# EAGLE design Quad VCA CTRL v1 (EAGLE 7.7.0)
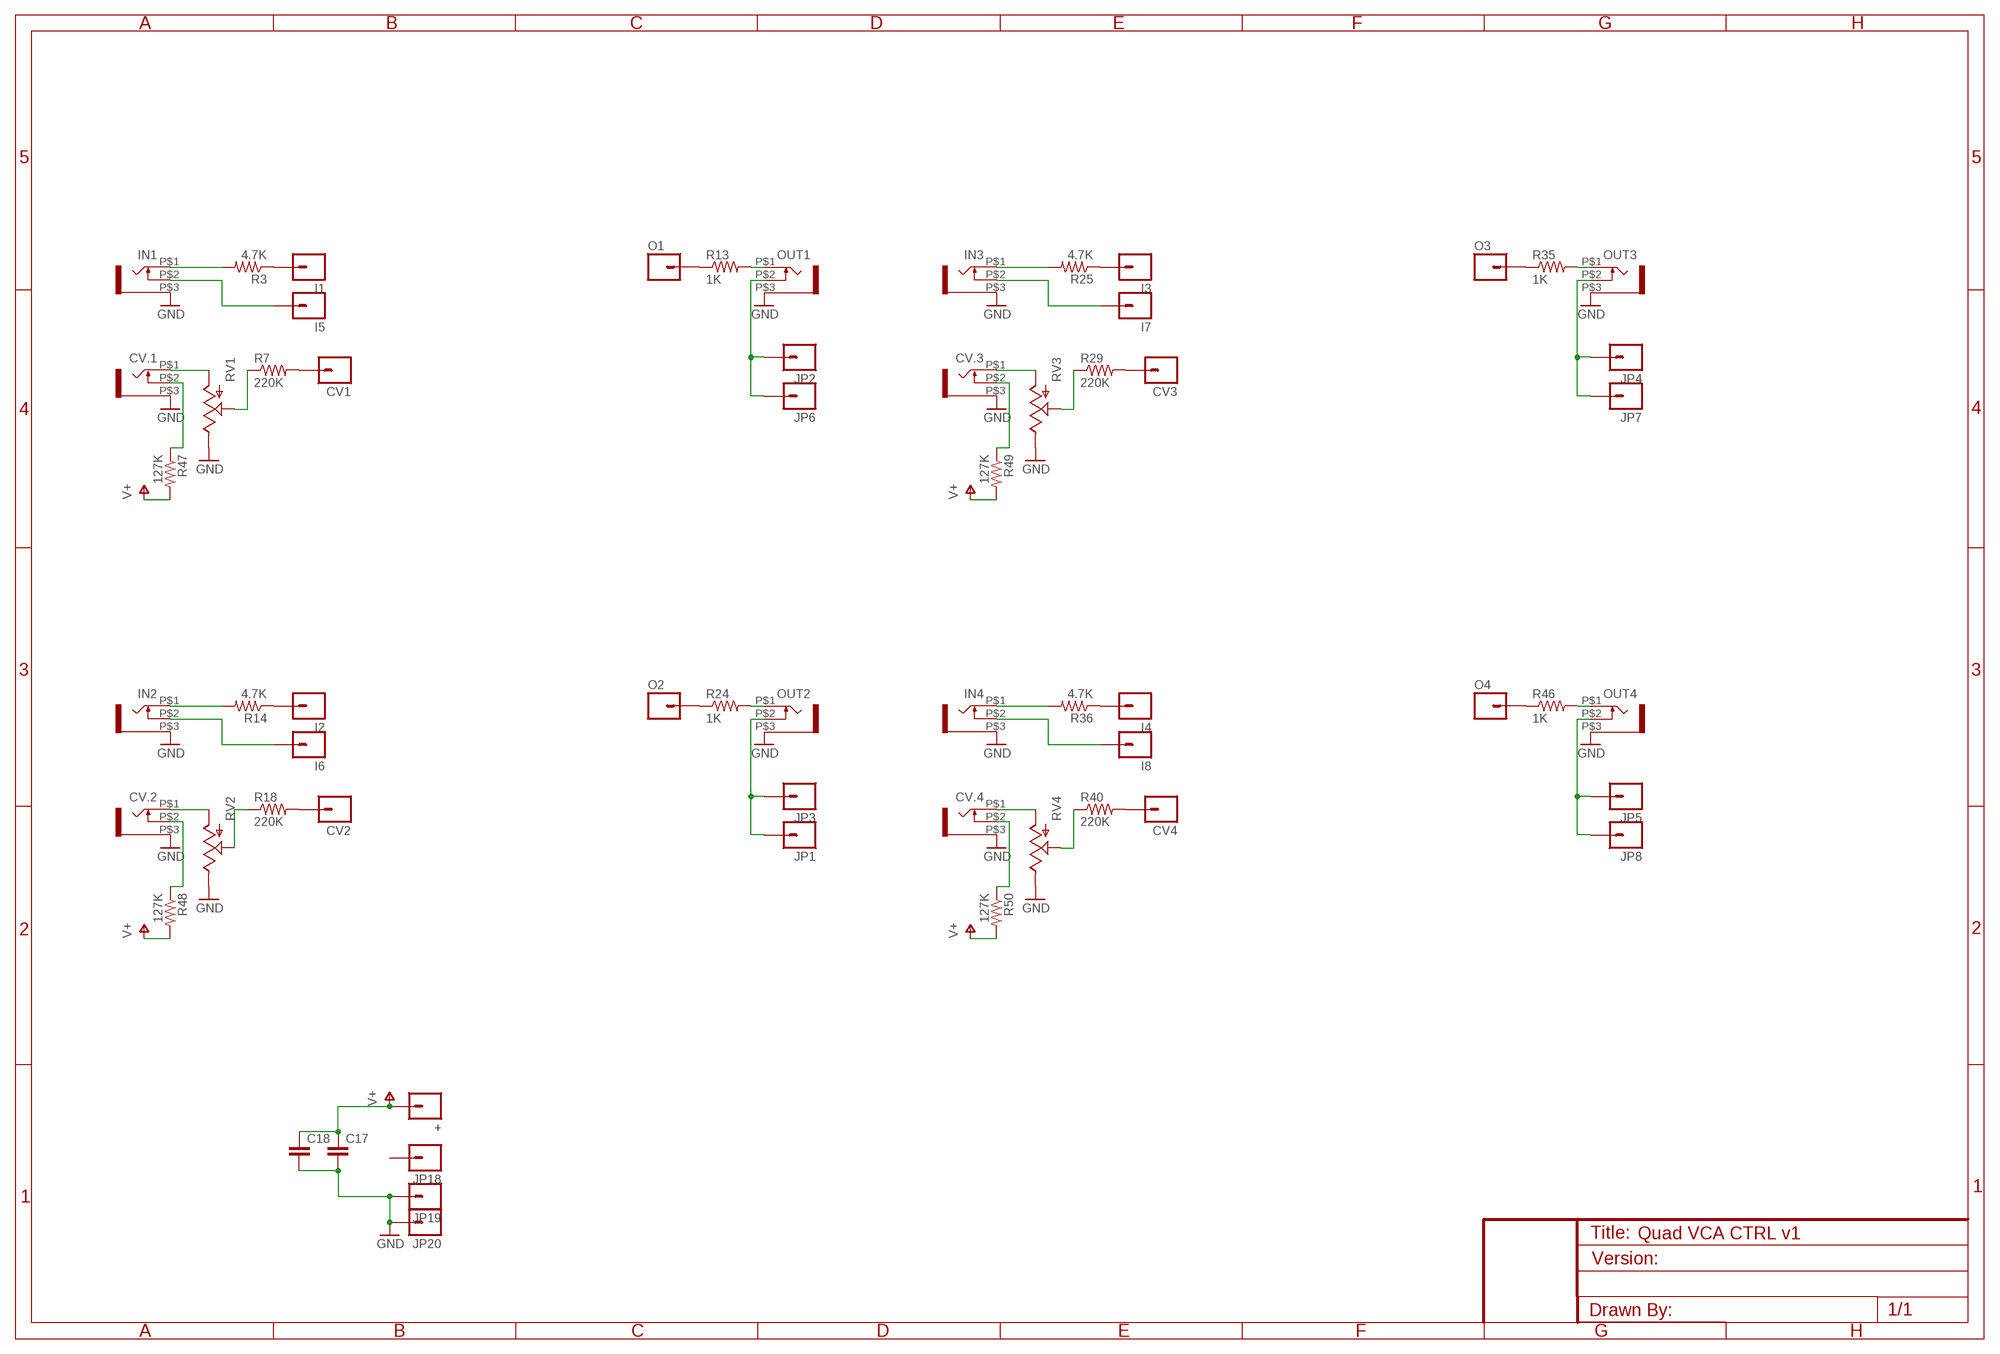
[diagram p0: schematic, sheet 1]

## Parts
+  M01PTH  [1X01]
C17  CAP0805  [0805]
C18  CAP0805  [0805]
CV1  M01PTH  [1X01]
CV2  M01PTH  [1X01]
CV3  M01PTH  [1X01]
CV4  M01PTH  [1X01]
CV.1  WQP-PJ301M-12_JACK  [WQP-PJ301M-12_JACK]
CV.2  WQP-PJ301M-12_JACK  [WQP-PJ301M-12_JACK]
CV.3  WQP-PJ301M-12_JACK  [WQP-PJ301M-12_JACK]
CV.4  WQP-PJ301M-12_JACK  [WQP-PJ301M-12_JACK]
I1  M01PTH  [1X01]
I2  M01PTH  [1X01]
I3  M01PTH  [1X01]
I4  M01PTH  [1X01]
I5  M01PTH  [1X01]
I6  M01PTH  [1X01]
I7  M01PTH  [1X01]
I8  M01PTH  [1X01]
IN1  WQP-PJ301M-12_JACK  [WQP-PJ301M-12_JACK]
IN2  WQP-PJ301M-12_JACK  [WQP-PJ301M-12_JACK]
IN3  WQP-PJ301M-12_JACK  [WQP-PJ301M-12_JACK]
IN4  WQP-PJ301M-12_JACK  [WQP-PJ301M-12_JACK]
JP1  M01PTH  [1X01]
JP2  M01PTH  [1X01]
JP3  M01PTH  [1X01]
JP4  M01PTH  [1X01]
JP5  M01PTH  [1X01]
JP6  M01PTH  [1X01]
JP7  M01PTH  [1X01]
JP8  M01PTH  [1X01]
JP18  M01PTH  [1X01]
JP19  M01PTH  [1X01]
JP20  M01PTH  [1X01]
O1  M01PTH  [1X01]
O2  M01PTH  [1X01]
O3  M01PTH  [1X01]
O4  M01PTH  [1X01]
OUT1  WQP-PJ301M-12_JACK  [WQP-PJ301M-12_JACK]
OUT2  WQP-PJ301M-12_JACK  [WQP-PJ301M-12_JACK]
OUT3  WQP-PJ301M-12_JACK  [WQP-PJ301M-12_JACK]
OUT4  WQP-PJ301M-12_JACK  [WQP-PJ301M-12_JACK]
R3  4.7K  RESISTOR0805-RES  [0805]
R7  220K  RESISTOR0805-RES  [0805]
R13  1K  RESISTOR0805-RES  [0805]
R14  4.7K  RESISTOR0805-RES  [0805]
R18  220K  RESISTOR0805-RES  [0805]
R24  1K  RESISTOR0805-RES  [0805]
R25  4.7K  RESISTOR0805-RES  [0805]
R29  220K  RESISTOR0805-RES  [0805]
R35  1K  RESISTOR0805-RES  [0805]
R36  4.7K  RESISTOR0805-RES  [0805]
R40  220K  RESISTOR0805-RES  [0805]
R46  1K  RESISTOR0805-RES  [0805]
R47  127K  RESISTOR0805-RES  [0805]
R48  127K  RESISTOR0805-RES  [0805]
R49  127K  RESISTOR0805-RES  [0805]
R50  127K  RESISTOR0805-RES  [0805]
RV1  POT  [ALPS_POT]
RV2  POT  [ALPS_POT]
RV3  POT  [ALPS_POT]
RV4  POT  [ALPS_POT]

## Nets
GND: C17.2 C18.2 CV.1.P$3 CV.2.P$3 CV.3.P$3 CV.4.P$3 IN1.P$3 IN2.P$3 IN3.P$3 IN4.P$3 JP19.1 JP20.1 OUT1.P$3 OUT2.P$3 OUT3.P$3 OUT4.P$3 RV1.P$1(E) RV2.P$1(E) RV3.P$1(E) RV4.P$1(E)
N$1: CV.1.P$2 R47.1
N$2: I1.1 R3.1
N$3: IN1.P$1 R3.2
N$4: CV1.1 R7.2
N$5: O1.1 R13.1
N$6: CV.2.P$1 RV2.P$3(A)
N$7: CV.2.P$2 R48.1
N$8: CV.3.P$2 R49.1
N$9: CV.4.P$2 R50.1
N$10: JP2.1 JP6.1 OUT1.P$2
N$11: IN2.P$1 R14.2
N$12: I2.1 R14.1
N$13: O2.1 R24.1
N$14: O3.1 R35.1
N$15: O4.1 R46.1
N$16: CV4.1 R40.2
N$17: I4.1 R36.1
N$18: CV3.1 R29.2
N$19: R18.1 RV2.P$2(S)
N$20: CV.1.P$1 RV1.P$3(A)
N$21: I3.1 R25.1
N$22: CV2.1 R18.2
N$23: I5.1 IN1.P$2
N$24: I6.1 IN2.P$2
N$25: OUT2.P$1 R24.2
N$26: IN3.P$1 R25.2
N$27: I7.1 IN3.P$2
N$28: I8.1 IN4.P$2
N$34: R7.1 RV1.P$2(S)
N$35: CV.3.P$1 RV3.P$3(A)
N$42: R29.1 RV3.P$2(S)
N$46: CV.4.P$1 RV4.P$3(A)
N$51: OUT1.P$1 R13.2
N$53: OUT3.P$1 R35.2
N$54: IN4.P$1 R36.2
N$62: R40.1 RV4.P$2(S)
N$63: JP1.1 JP3.1 OUT2.P$2
N$68: OUT4.P$1 R46.2
N$69: JP4.1 JP7.1 OUT3.P$2
N$72: JP5.1 JP8.1 OUT4.P$2
V+: +.1 C17.1 C18.1 R47.2 R48.2 R49.2 R50.2
Unconnected: JP18.1

## Library data of the parts
+ CV1-CV4 I1-I8 JP1-JP8 JP18-JP20 O1-O4 = SparkFun-Connectors:M01: Header 1 Standard 1-pin 0.1" header. Use with straight break away headers (SKU : PRT-00116), right angle break away headers (PRT-00553), swiss pins (PRT-00743), machine pins (PRT-00117), and female headers (PRT-00115).
C17 C18 = SparkFun-Capacitors:CAP: Capacitor Standard 0603 ceramic capacitor, and 0.1" leaded capacitor.
CV.1-CV.4 IN1-IN4 OUT1-OUT4 = thonkiconn:WQP-PJ301M-12_JACK
R3 R7 R13 R14 R18 R24 R25 R29 R35 R36 R40 R46-R50 = SparkFun-Resistors:RESISTOR: Resistor Basic schematic elements and footprints for 0603, 1206, and PTH resistors.
RV1-RV4 = SparkFun-Electromechanical:POT; PROD_ID: RES-09177

## Board
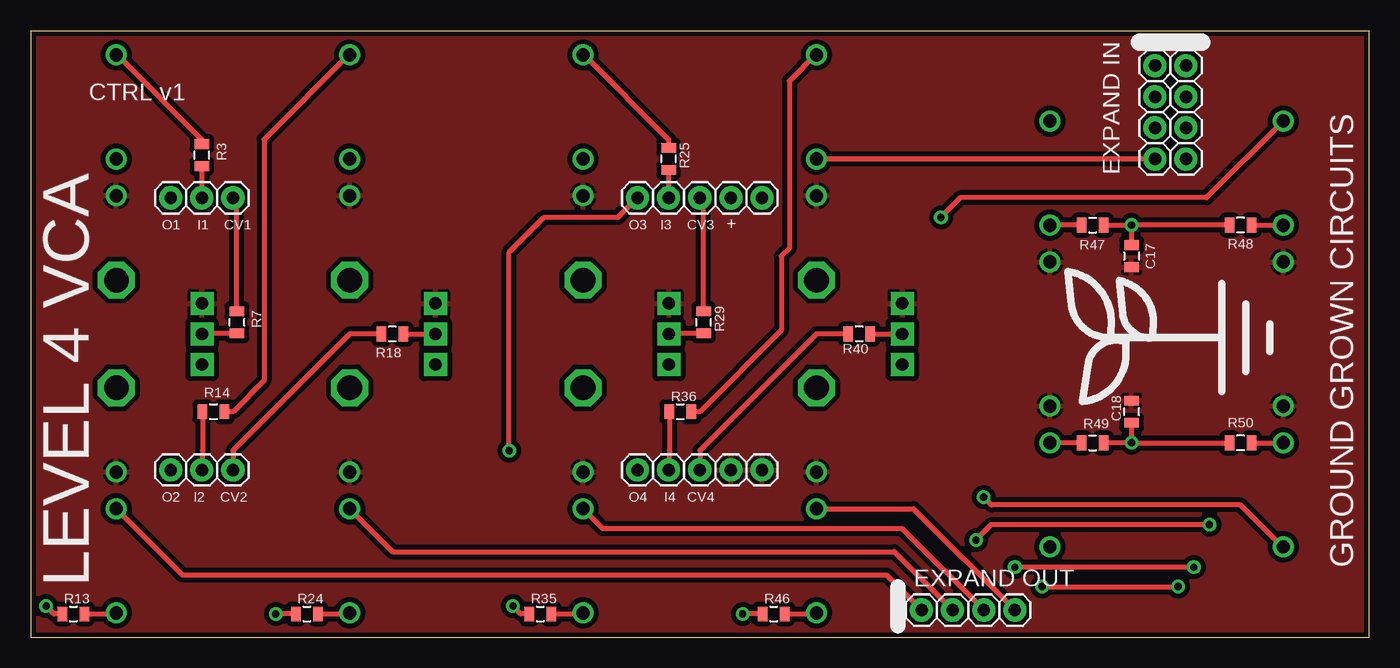
[diagram p1: board, top side]
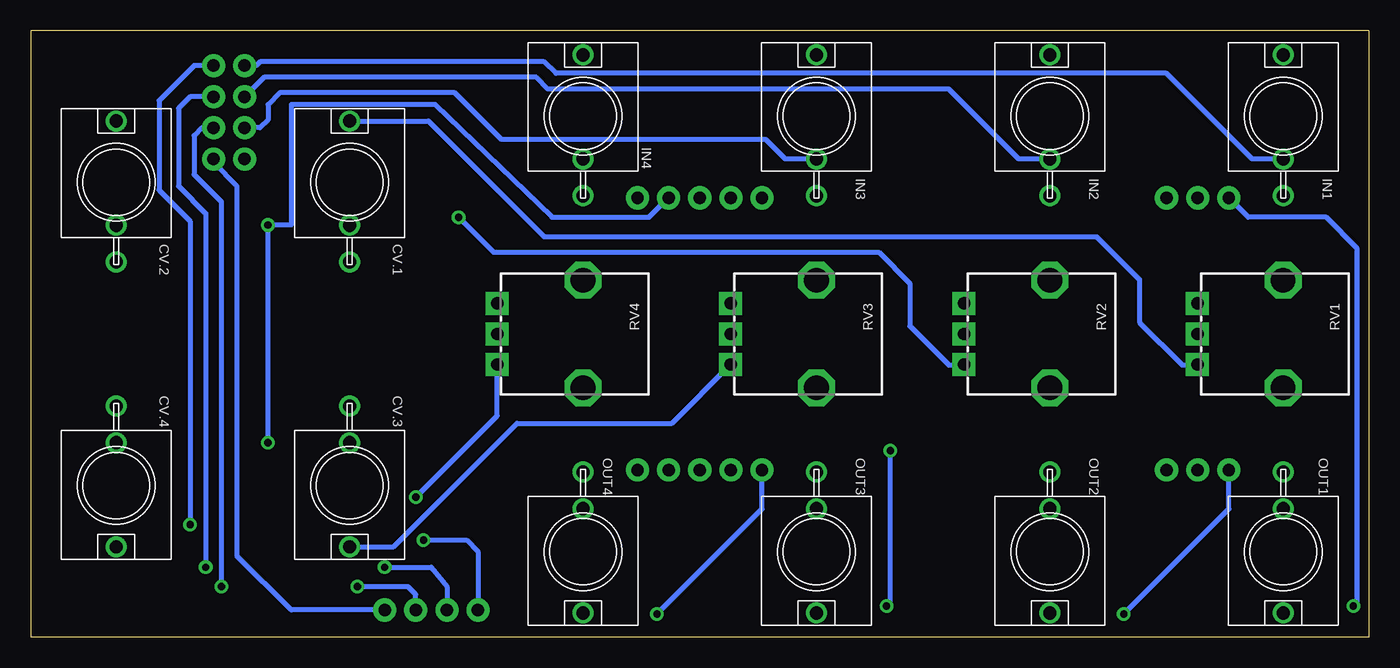
[diagram p2: board, bottom side, seen from below]

Size 109.22 x 49.53 mm. Coordinates in mm from the lower left corner, seen from the top.
Outline: 0,0 109.22,0 109.22,49.53 0,49.53 0,0
Copper layers (1*16): Top 0.035mm / dielectric 1.5mm / Bottom 0.035mm
Design rules "SparkFun": minimum track width 8mil, minimum drill 20mil, track to track 8mil, track to pad 8mil, pad to pad 8mil, via to via 8mil, smd to smd 8mil, copper to edge 8mil, drill to drill 8mil, minimum pad ring 12mil, minimum via ring 10mil, stop-mask expansion 4mil, vias tented up to drill 20mil, thermal gap 10mil

### Footprints (pad centres in the part's own frame; a part is rotated, then mirrored left to right if it is on the bottom)
1X01 = drill 1.016 pad 1.88: 1 0,0
0805 = smd 0.8 x 1.2: 1 -0.9,0; 2 0.9,0
WQP-PJ301M-12_JACK = drill 1.1: P$1 0,5; P$2 0,-3.5; P$3 0,-6.5
ALPS_POT = drill 1 pad 1.88 square: P$1 7,-2.5; P$2 7,0; P$3 7,2.5 | drill 2 octagon: P$4 0,-4.4; P$5 0,4.4

### Placement (x,y rotation side)
+  57.15,35.88 0 top
C17  89.85,31.11 270 top
C18  89.85,18.41 90 top
CV1  16.51,35.88 0 top
CV2  16.51,13.65 0 top
CV3  54.61,35.88 0 top
CV4  54.61,13.65 0 top
CV.1  83.19,37.15 0 bottom
CV.2  102.23,37.15 0 bottom
CV.3  83.19,12.38 180 bottom
CV.4  102.23,12.38 180 bottom
I1  13.97,35.88 0 top
I2  13.97,13.65 0 top
I3  52.07,35.88 0 top
I4  52.07,13.65 0 top
I5  91.76,46.67 90 top
I6  91.76,44.13 90 top
I7  91.76,41.59 90 top
I8  91.76,39.05 90 top
IN1  6.99,42.55 0 bottom
IN2  26.04,42.55 0 bottom
IN3  45.09,42.55 0 bottom
IN4  64.14,42.55 0 bottom
JP1  94.3,44.13 270 top
JP2  72.71,2.22 90 top
JP3  75.25,2.22 90 top
JP4  77.79,2.22 90 top
JP5  80.33,2.22 90 top
JP6  94.3,46.67 270 top
JP7  94.3,41.59 270 top
JP8  94.3,39.05 270 top
JP18  59.69,35.88 0 top
JP19  59.69,13.65 0 top
JP20  57.15,13.65 0 top
O1  11.43,35.88 0 top
O2  11.43,13.65 0 top
O3  49.53,35.88 0 top
O4  49.53,13.65 0 top
OUT1  6.99,6.99 180 bottom
OUT2  26.04,6.99 180 bottom
OUT3  45.09,6.99 180 bottom
OUT4  64.14,6.99 180 bottom
R3  13.97,39.37 90 top
R7  16.83,25.72 90 top
R13  3.49,1.91 0 top
R14  14.92,18.41 0 top
R18  29.53,24.77 180 top
R24  22.54,1.91 0 top
R25  52.07,39.05 90 top
R29  54.93,25.72 90 top
R35  41.59,1.91 0 top
R36  53.02,18.41 0 top
R40  67.63,24.77 180 top
R46  60.64,1.91 0 top
R47  86.68,33.66 0 top
R48  98.74,33.66 180 top
R49  86.68,15.88 0 top
R50  98.74,15.88 180 top
RV1  6.99,24.77 180 bottom
RV2  26.04,24.77 180 bottom
RV3  45.09,24.77 180 bottom
RV4  64.14,24.77 180 bottom
U$1  [LOGO_LARGE]  97.16,24.45 90 top

### Tracks (layer width: path | path; a pad name or v marks a point on that pad's centre or on a via)
GND
  pour Top (isolate 0.406): 0,0 109.22,0 109.22,49.53 0,49.53
N$1
  Top 0.406: R47.1 CV.1.P$2
N$2
  Top 0.406: R3.1 I1.1
N$3
  Top 0.406: IN1.P$1 7.07,47.55 13.97,40.64 R3.2
N$4
  Top 0.406: R7.2 16.83,35.56 CV1.1
N$5  (via drill 0.6)
  Top 0.406: R13.1 1.91,1.91 v1.27,2.54
  Bottom 0.406: v1.27,2.54 0.95,2.86 0.95,31.75 3.49,34.29 9.84,34.29 O1.1
N$6  (via drill 0.6)
  Top 0.406: CV.2.P$1 95.97,35.88 75.88,35.88 v74.3,34.29
  Bottom 0.406: v74.3,34.29 71.44,31.43 40.01,31.43 37.47,28.89 37.47,25.4 34.29,22.23 33.08,22.23 RV2.P$3
N$7
  Top 0.406: R48.1 CV.2.P$2
N$8
  Top 0.406: R49.1 CV.3.P$2
N$9
  Top 0.406: R50.1 CV.4.P$2
N$10  (via drill 0.6)
  Top 0.406: OUT1.P$2 12.38,5.08 69.85,5.08 JP2.1 | v77.15,7.94 78.42,9.21 v96.2,9.21
  Bottom 0.406: JP6.1 95.89,46.67 98.74,43.81 98.74,36.51 96.2,33.97 v96.2,9.21 | v77.15,7.94 73.66,7.94 72.71,6.99 JP2.1
N$11
  Top 0.406: IN2.P$1 25.95,47.55 19.05,40.64 19.05,20.95 16.51,18.41 R14.2
N$12
  Top 0.406: R14.1 14.02,15.29 I2.1
N$13  (via drill 0.6)
  Top 0.406: R24.1 v20,1.91
  Bottom 0.406: v20,1.91 11.43,10.48 O2.1
N$14  (via drill 0.6)
  Top 0.406: R35.1 40.01,1.91 v39.37,2.54 | v39.05,15.24 39.05,31.43 41.91,34.29 47.94,34.29 O3.1
  Bottom 0.406: v39.37,2.54 39.05,2.86 v39.05,15.24
N$15  (via drill 0.6)
  Top 0.406: R46.1 v58.1,1.91
  Bottom 0.406: v58.1,1.91 49.53,10.48 O4.1
N$16
  Top 0.406: R40.2 64.14,24.77 54.61,15.24 CV4.1
N$17
  Top 0.406: R36.1 52.12,15.29 I4.1
N$18
  Top 0.406: R29.2 54.93,35.56 CV3.1
N$19
  Top 0.406: R18.1 RV2.P$2
N$20
  Bottom 0.406: CV.1.P$1 76.75,42.15 67.31,32.7 22.23,32.7 18.73,29.21 18.73,25.72 15.24,22.23 14.03,22.23 RV1.P$3
N$21
  Top 0.406: R25.1 I3.1
N$22
  Top 0.406: R18.2 26.04,24.77 16.51,15.24 CV2.1
N$23
  Bottom 0.406: IN1.P$2 9.52,39.05 16.51,46.04 66.36,46.04 67.31,46.99 90.49,46.99 90.81,46.67 I5.1
N$24
  Bottom 0.406: IN2.P$2 28.57,39.05 34.29,44.77 66.99,44.77 67.94,45.72 90.17,45.72 I6.1
N$25
  Top 0.406: R24.2 25.95,1.91 OUT2.P$1
N$26
  Top 0.406: IN3.P$1 45.16,47.55 52.07,40.64 R25.2
N$27
  Bottom 0.406: IN3.P$2 47.62,39.05 49.21,40.64 70.8,40.64 74.61,44.45 88.9,44.45 89.85,43.5 89.85,42.23 90.49,41.59 I7.1
N$28
  Top 0.406: I8.1 IN4.P$2
N$34
  Top 0.406: R7.1 14.04,24.82 RV1.P$2
N$35
  Bottom 0.406: CV.3.P$1 79.61,7.38 69.53,17.46 56.89,17.46 RV3.P$3
N$42
  Top 0.406: R29.1 52.14,24.82 RV3.P$2
N$46  (via drill 0.6)
  Top 0.406: CV.4.P$1 102.16,7.38 98.74,10.79 78.42,10.79 v77.79,11.43
  Bottom 0.406: v77.79,11.43 71.14,18.08 RV4.P$3
N$51
  Top 0.406: R13.2 6.91,1.91 OUT1.P$1
N$53
  Top 0.406: R35.2 45.01,1.91 OUT3.P$1
N$54
  Top 0.406: IN4.P$1 64.06,47.55 61.91,45.4 61.91,31.75 61.28,31.11 61.28,25.08 54.61,18.41 R36.2
N$62
  Top 0.406: R40.1 RV4.P$2
N$63  (via drill 0.6)
  Top 0.406: OUT2.P$2 29.53,6.99 70.48,6.99 JP3.1 | v94.93,5.71 v80.33,5.71
  Bottom 0.406: JP1.1 96.2,44.13 97.16,43.18 97.16,36.83 94.93,34.61 v94.93,5.71 | v80.33,5.71 76.52,5.71 75.25,4.13 JP3.1
N$68
  Top 0.406: R46.2 64.06,1.91 OUT4.P$1
N$69  (via drill 0.6)
  Top 0.406: OUT3.P$2 46.67,8.89 71.12,8.89 JP4.1 | v82.55,4.13 v93.66,4.13
  Bottom 0.406: JP7.1 95.25,41.59 95.89,40.96 95.89,37.78 93.66,35.56 v93.66,4.13 | JP4.1 77.79,3.49 78.42,4.13 v82.55,4.13
N$72
  Top 0.406: OUT4.P$2 72.06,10.48 JP5.1
  Bottom 0.406: JP8.1 94.3,38.73 92.39,36.83 92.39,6.67 87.95,2.22 JP5.1
V+  (via drill 0.6)
  Top 0.406: v89.85,33.66 C17.1 | C18.1 v89.85,15.88 | R47.2 v89.85,33.66 | R48.2 v89.85,33.66 | v89.85,15.88 R49.2 | v89.85,15.88 R50.2
  Bottom 0.406: v89.85,15.88 v89.85,33.66 87.95,33.66 87.95,43.5 76.2,43.5 66.67,34.29 58.74,34.29 +.1

### Text on the board
tPlace: CTRL v1 | EXPAND IN | GROUND GROWN CIRCUITS | LEVEL 4 VCA | EXPAND OUT